# EAGLE design 2164_svf_breakout_planes_smd (EAGLE 9.6.2)
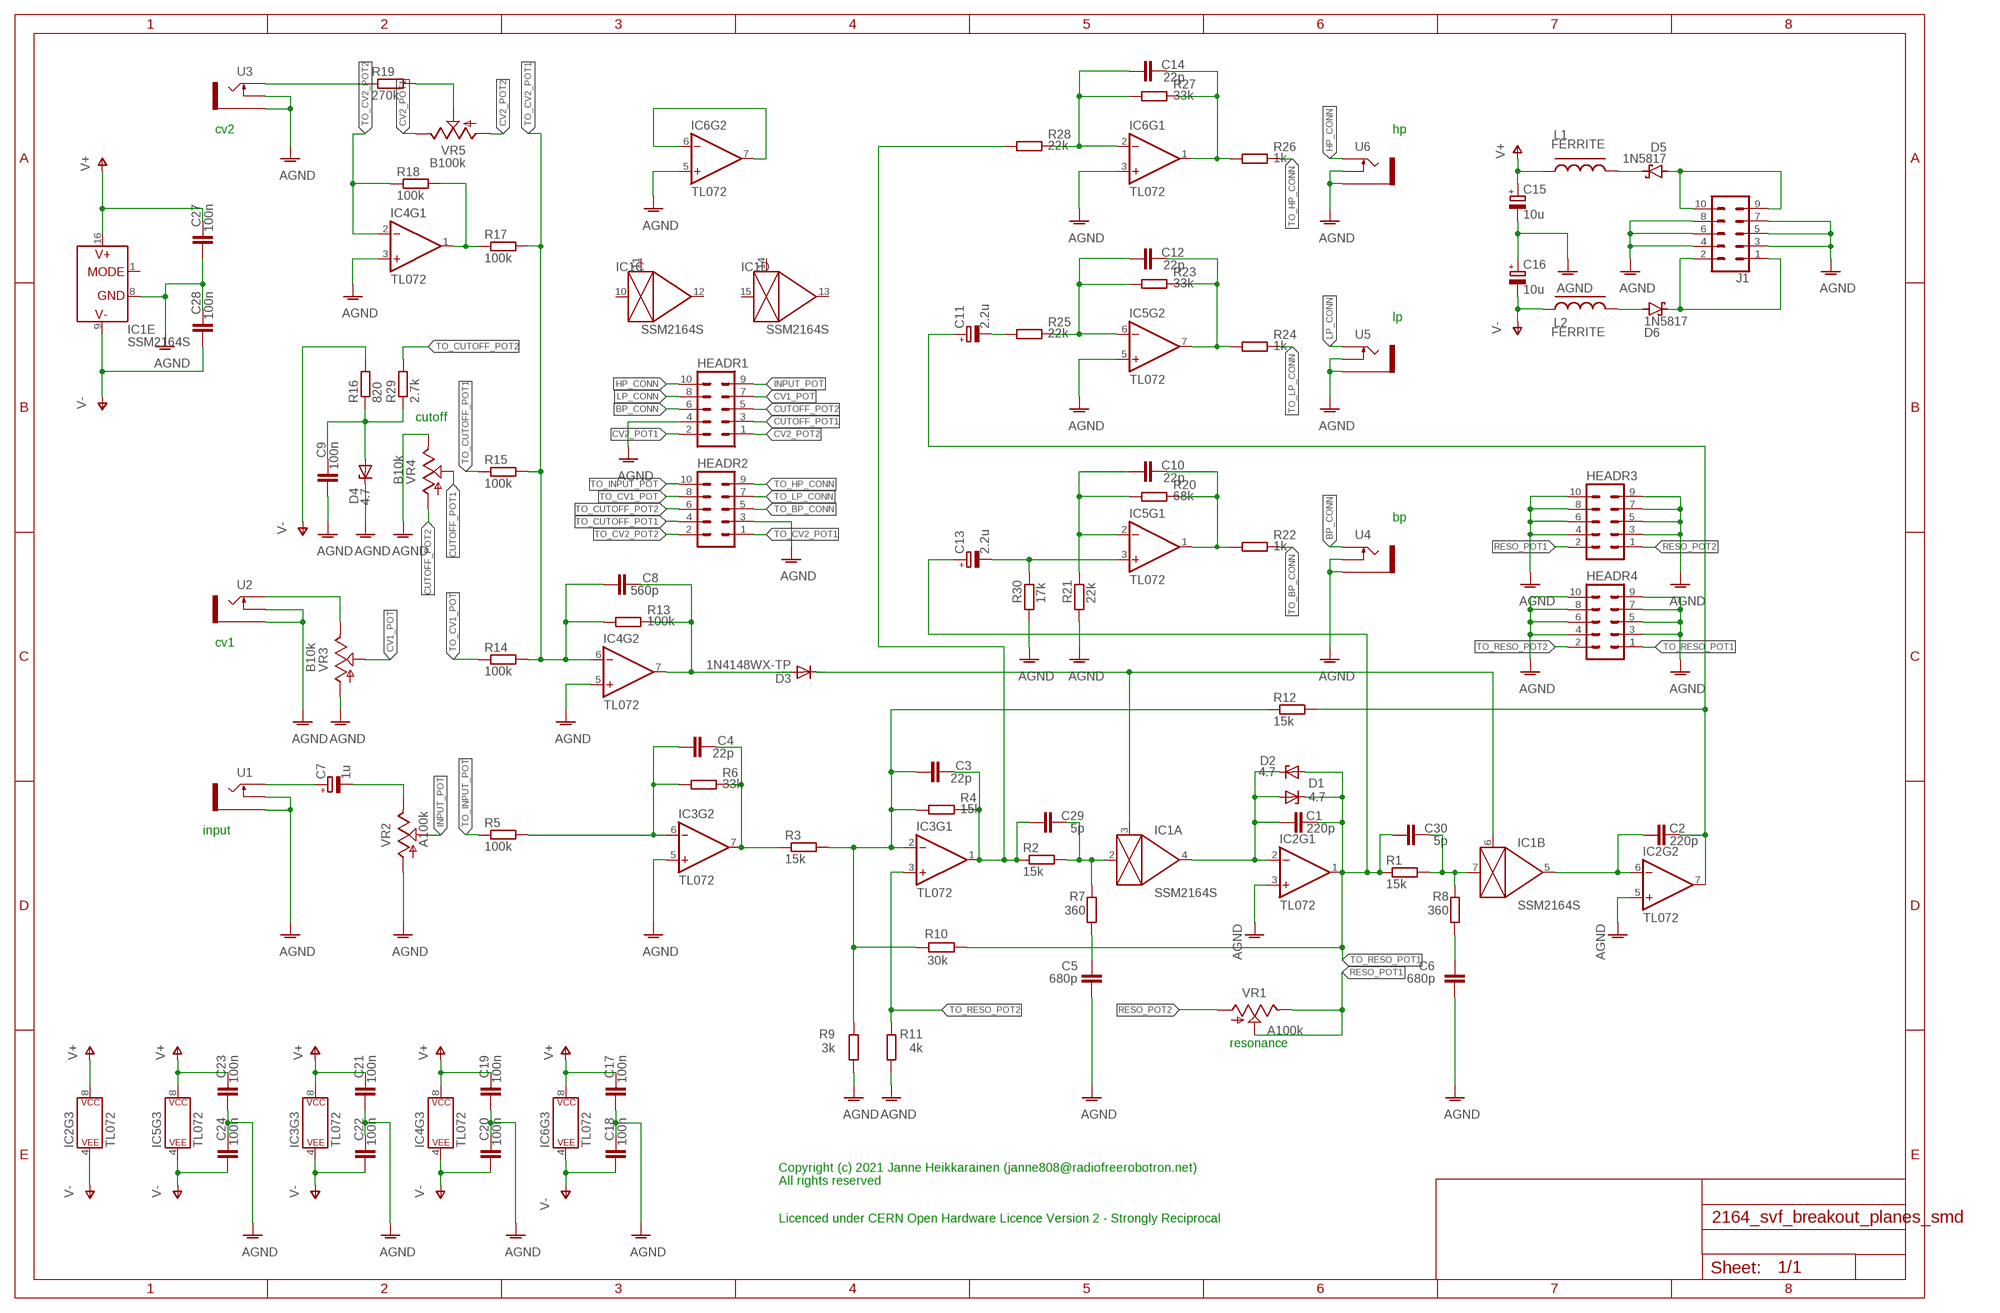
[diagram p0: schematic, sheet 1]

## Parts
C1  220p  C-EUC0603  [C0603]
C2  220p  C-EUC0603  [C0603]
C3  22p  C-EUC0603  [C0603]
C4  22p  C-EUC0603  [C0603]
C5  680p  C-EUC0603  [C0603]
C6  680p  C-EUC0603  [C0603]
C7  1u  CPOL-EUB  [PANASONIC_B]
C8  560p  C-EUC0603  [C0603]
C9  100n  C-EUC0603  [C0603]
C10  22p  C-EUC0603  [C0603]
C11  2.2u  CPOL-EUB  [PANASONIC_B]
C12  22p  C-EUC0603  [C0603]
C13  2.2u  CPOL-EUB  [PANASONIC_B]
C14  22p  C-EUC0603  [C0603]
C15  10u  CPOL-EUB  [PANASONIC_B]
C16  10u  CPOL-EUB  [PANASONIC_B]
C17  100n  C-EUC0603  [C0603]
C18  100n  C-EUC0603  [C0603]
C19  100n  C-EUC0603  [C0603]
C20  100n  C-EUC0603  [C0603]
C21  100n  C-EUC0603  [C0603]
C22  100n  C-EUC0603  [C0603]
C23  100n  C-EUC0603  [C0603]
C24  100n  C-EUC0603  [C0603]
C27  100n  C-EUC0603  [C0603]
C28  100n  C-EUC0603  [C0603]
C29  5p  C-EUC0603  [C0603]
C30  5p  C-EUC0603  [C0603]
D1  4.7  DIODE_ZENER-DIODESOD80C  [DIODE_SOD80C]
D2  4.7  DIODE_ZENER-DIODESOD80C  [DIODE_SOD80C]
D3  1N4148WX-TP  [SOD323R-INFINEON]
D4  4.7  DIODE_ZENER-DIODESOD80C  [DIODE_SOD80C]
D5  1N5817  SCHOTTKY-DIODEDO35-7  [DO35-7]
D6  1N5817  SCHOTTKY-DIODEDO35-7  [DO35-7]
HEADR1  10PIN_BACKSIDE  [10PIN_BACKSIDE]
HEADR2  10PIN_BACKSIDE  [10PIN_BACKSIDE]
HEADR3  10PIN_BACKSIDE  [10PIN_BACKSIDE]
HEADR4  10PIN_BACKSIDE  [10PIN_BACKSIDE]
IC1  SSM2164S  [SOIC16N]
IC2  TL072  OPAMP-DUALU  [SO08]
IC3  TL072  OPAMP-DUALU  [SO08]
IC4  TL072  OPAMP-DUALU  [SO08]
IC5  TL072  OPAMP-DUALU  [SO08]
IC6  TL072  OPAMP-DUALU  [SO08]
J1  CONN_05X2SHD  [2X5-SHROUDED]
L1  FERRITE  EXC3BP  [0603]
L2  FERRITE  EXC3BP  [0603]
R1  15k  R-EU_R0603  [R0603]
R2  15k  R-EU_R0603  [R0603]
R3  15k  R-EU_R0603  [R0603]
R4  15k  R-EU_R0603  [R0603]
R5  100k  R-EU_R0603  [R0603]
R6  33k  R-EU_R0603  [R0603]
R7  360  R-EU_R0603  [R0603]
R8  360  R-EU_R0603  [R0603]
R9  3k  R-EU_R0603  [R0603]
R10  30k  R-EU_R0603  [R0603]
R11  4k  R-EU_R0603  [R0603]
R12  15k  R-EU_R0603  [R0603]
R13  100k  R-EU_R0603  [R0603]
R14  100k  R-EU_R0603  [R0603]
R15  100k  R-EU_R0603  [R0603]
R16  820  R-EU_R0603  [R0603]
R17  100k  R-EU_R0603  [R0603]
R18  100k  R-EU_R0603  [R0603]
R19  270k  R-EU_R0603  [R0603]
R20  68k  R-EU_R0603  [R0603]
R21  22k  R-EU_R0603  [R0603]
R22  1k  R-EU_R0603  [R0603]
R23  33k  R-EU_R0603  [R0603]
R24  1k  R-EU_R0603  [R0603]
R25  22k  R-EU_R0603  [R0603]
R26  1k  R-EU_R0603  [R0603]
R27  33k  R-EU_R0603  [R0603]
R28  22k  R-EU_R0603  [R0603]
R29  2.7k  R-EU_R0603  [R0603]
R30  17k  R-EU_R0603  [R0603]
U1  THONKICONNNEW  [WQP-PJ301M-12_JACK]
U2  THONKICONNNEW  [WQP-PJ301M-12_JACK]
U3  THONKICONNNEW  [WQP-PJ301M-12_JACK]
U4  THONKICONNNEW  [WQP-PJ301M-12_JACK]
U5  THONKICONNNEW  [WQP-PJ301M-12_JACK]
U6  THONKICONNNEW  [WQP-PJ301M-12_JACK]
VR1  A100k  9MM_SNAP-IN_POT_  [9MM_SNAP-IN_POT]
VR2  A100k  9MM_SNAP-IN_POT_  [9MM_SNAP-IN_POT]
VR3  B10k  9MM_SNAP-IN_POT_  [9MM_SNAP-IN_POT]
VR4  B10k  9MM_SNAP-IN_POT_  [9MM_SNAP-IN_POT]
VR5  B100k  9MM_SNAP-IN_POT_  [9MM_SNAP-IN_POT]

## Nets
AGND: C5.1 C6.1 C9.1 C15.- C16.+ C17.1 C18.2 C19.1 C20.2 C21.1 C22.2 C23.1 C24.2 C27.1 C28.2 D4.C HEADR1.4 HEADR2.3 HEADR3.3 HEADR3.4 HEADR3.5 HEADR3.6 HEADR3.7 HEADR3.8 HEADR3.9 HEADR3.10 HEADR4.3 HEADR4.4 HEADR4.5 HEADR4.6 HEADR4.7 HEADR4.8 HEADR4.9 HEADR4.10 IC1.8(E:GND) IC2.3(+IN) IC2.5(+IN) IC3.5(+IN) IC4.3(+IN) IC4.5(+IN) IC5.5(+IN) IC6.3(+IN) IC6.5(+IN) J1.3 J1.4 J1.5 J1.6 J1.7 J1.8 R9.1 R11.1 R21.1 R30.1 U1.P$2_SWITCH(SWITCH) U1.P$3_SLEEVE(SLEEVE) U2.P$2_SWITCH(SWITCH) U2.P$3_SLEEVE(SLEEVE) U3.P$2_SWITCH(SWITCH) U3.P$3_SLEEVE(SLEEVE) U4.P$2_SWITCH(SWITCH) U4.P$3_SLEEVE(SLEEVE) U5.P$2_SWITCH(SWITCH) U5.P$3_SLEEVE(SLEEVE) U6.P$2_SWITCH(SWITCH) U6.P$3_SLEEVE(SLEEVE) VR2.1(A) VR3.1(A) VR4.3(E)
BP_CONN: HEADR1.6 U4.P$1_TIP(TIP)
CUTOFF_POT1: HEADR1.3 VR4.2(S)
CUTOFF_POT2: HEADR1.5 VR4.1(A)
CV1_POT: HEADR1.7 VR3.2(S)
CV2_POT1: HEADR1.2 VR5.3(E)
CV2_POT2: HEADR1.1 VR5.1(A)
HP_CONN: HEADR1.10 U6.P$1_TIP(TIP)
INPUT_POT: HEADR1.9 VR2.2(S)
LP_CONN: HEADR1.8 U5.P$1_TIP(TIP)
N$1: C1.1 D1.A D2.C IC1.4(A:OUT) IC2.2(-IN)
N$2: C2.1 IC1.5(B:OUT) IC2.6(-IN)
N$4: C30.2 IC1.7(B:IN) R1.2 R8.2
N$5: C3.2 C29.1 IC3.1(OUT) R2.1 R4.2 R28.1
N$6: C29.2 IC1.2(A:IN) R2.2 R7.2
N$7: C9.2 D4.A R16.1 R29.1
N$8: C4.2 IC3.7(OUT) R3.1 R6.2
N$9: C3.1 IC3.2(-IN) R3.2 R4.1 R9.2 R10.2 R12.1
N$10: C4.1 IC3.6(-IN) R5.2 R6.1
N$12: C2.2 C11.+ IC2.7(OUT) R12.2
N$13: C7.- VR2.3(E)
N$14: C7.+ U1.P$1_TIP(TIP)
N$15: C5.2 R7.1
N$16: C6.2 R8.1
N$17: C8.2 D3.A IC4.7(OUT) R13.2
N$18: D3.C IC1.3(A:CTRL) IC1.6(B:CTRL)
N$21: U2.P$1_TIP(TIP) VR3.3(E)
N$23: IC4.1(OUT) R17.1 R18.2
N$26: C10.1 IC5.2(-IN) R20.1 R21.2
N$27: R19.1 U3.P$1_TIP(TIP)
N$28: R19.2 VR5.2(S)
N$29: C10.2 IC5.1(OUT) R20.2 R22.1
N$30: C13.- IC5.3(+IN) R30.2
N$31: C12.1 IC5.6(-IN) R23.1 R25.2
N$33: C12.2 IC5.7(OUT) R23.2 R24.1
N$34: C11.- R25.1
N$37: IC6.6(-IN) IC6.7(OUT)
N$38: D5.C L1.2
N$39: C14.2 IC6.1(OUT) R26.1 R27.2
N$40: C14.1 IC6.2(-IN) R27.1 R28.2
N$41: D6.A L2.2
N$42: D6.C J1.1 J1.2
N$43: D5.A J1.9 J1.10
RESO_POT1: HEADR3.2 VR1.2(S) VR1.3(E)
RESO_POT2: HEADR3.1 VR1.1(A)
TO_BP_CONN: HEADR2.5 R22.2
TO_CUTOFF_POT1: HEADR2.4 R15.1
TO_CUTOFF_POT2: HEADR2.6 R29.2
TO_CV1_POT: HEADR2.8 R14.1
TO_CV2_POT1: C8.1 HEADR2.1 IC4.6(-IN) R13.1 R14.2 R15.2 R17.2
TO_CV2_POT2: HEADR2.2 IC4.2(-IN) R18.1
TO_HP_CONN: HEADR2.9 R26.2
TO_INPUT_POT: HEADR2.10 R5.1
TO_LP_CONN: HEADR2.7 R24.2
TO_RESO_POT1: C1.2 C13.+ C30.1 D1.C D2.A HEADR4.1 IC2.1(OUT) R1.1 R10.1
TO_RESO_POT2: HEADR4.2 IC3.3(+IN) R11.2
V+: C15.+ C17.2 C19.2 C21.2 C23.2 C27.2 IC1.16(E:V+) IC2.8(P$V+) IC3.8(P$V+) IC4.8(P$V+) IC5.8(P$V+) IC6.8(P$V+) L1.1
V-: C16.- C18.1 C20.1 C22.1 C24.1 C28.1 IC1.9(E:V-) IC2.4(P$V-) IC3.4(P$V-) IC4.4(P$V-) IC5.4(P$V-) IC6.4(P$V-) L2.1 R16.2
Unconnected: IC1.1(E:MODE) IC1.10(C:IN) IC1.11(C:CTRL) IC1.12(C:OUT) IC1.13(D:OUT) IC1.14(D:CTRL) IC1.15(D:IN)

## Notes on the sheet
- cv2 | hp
- lp
- cutoff
- bp
- cv1
- input
- resonance
- Copyright (c) 2021 Janne Heikkarainen (janne808@radiofreerobotron.net)
  All rights reserved
- Licenced under CERN Open Hardware Licence Version 2 - Strongly Reciprocal

## Library data of the parts
C1-C6 C8-C10 C12 C14 C17-C24 C27-C30 = rcl:C-EU: CAPACITOR, European symbol; SPICEPREFIX: C
C7 C11 C13 C15 C16 = rcl:CPOL-EU: POLARIZED CAPACITOR, European symbol; SPICEPREFIX: C
D1 D2 D4 = Diode-SMD:DIODE_ZENER-DIODE: Z-Diode
D3 = Diode-SMD:1N4148WX-TP
D5 D6 = diode:SCHOTTKY-DIODE: Schottky Diode
HEADR1-HEADR4 = MusicThingModular:10PIN_BACKSIDE: PIN HEADER; OC_FARNELL: unknown; OC_NEWARK: unknown
IC1 = ssm2164:SSM2164
IC2-IC6 = SparkFun-IC-Amplifiers:OPAMP-DUAL: Generic op-amp footprint This component is for the standard 358 pinning of a dual op-amp From the LM358 datasheet: Pin 1: Output A Pin 2: Inverting Input A Pin 3: Non-Inverting Input A Pin 4: Gnd Pin 5: Non-Inverting Input B Pin 6: Inverting Input B Pin 7: Output B Pin 8: V+; PROD_ID: NA-XXXXX; VALUE: OP-AMP
J1 = SparkFun-Connectors:CONN_05X2: Multi connection point. Often used as Generic Header-pin footprint for 0.1 inch spaced/style header connections For AVR SPI programming port, see special device with nice symbol: "AVR_SPI_PROG_5x2.dev" You can populate with any combo of single row headers, but if you'd like an exact match, check these: 2x5 AVR ICSP Male Header <https://www.sparkfun.com/products/778> (PRT-00778) 2x5 Pin Shrouded Header <https://www.sparkfun.com/products/8506> (PRT-08506) On any of the 0.1 inch spaced packages, you can populate with these: Break Away Headers - Straight <https://www.sparkfun.com/products/116> (PRT-00116) Break Away Male Headers - Right Angle <https://www.sparkfun.com/products/553> (PRT-00553) Female Headers <https://www.sparkfun.com/products/115> (PRT-00115) Break Away Headers - Machine Pin <https://www.sparkfun.com/products/117> (PRT-00117) Break Away Female Headers - Swiss Machine Pin <https://www.sparkfun.com/products/743> (PRT-00743) Special note: the shrouded connector mates well with our 5x2 ribbon cables: 2x5 Pin IDC Ribbon Cable <https://www.sparkfun.com/products/8535> (PRT-08535); PROD_ID: CONN-08671; SF_ID: PRT-08506
L1 L2 = barthess:EXC3BP: Chip Bead Core; PARTNO: ?
R1-R30 = rcl:R-EU_: RESISTOR, European symbol; SPICEPREFIX: R
U1-U6 = MusicThingModular:THONKICONN: 3.5mm socket for Eurorack modular synths
VR1-VR5 = MusicThingModular:9MM_SNAP-IN_POT: 9mm vertical snap-in pot, Alpha / Panasonic style

## Board
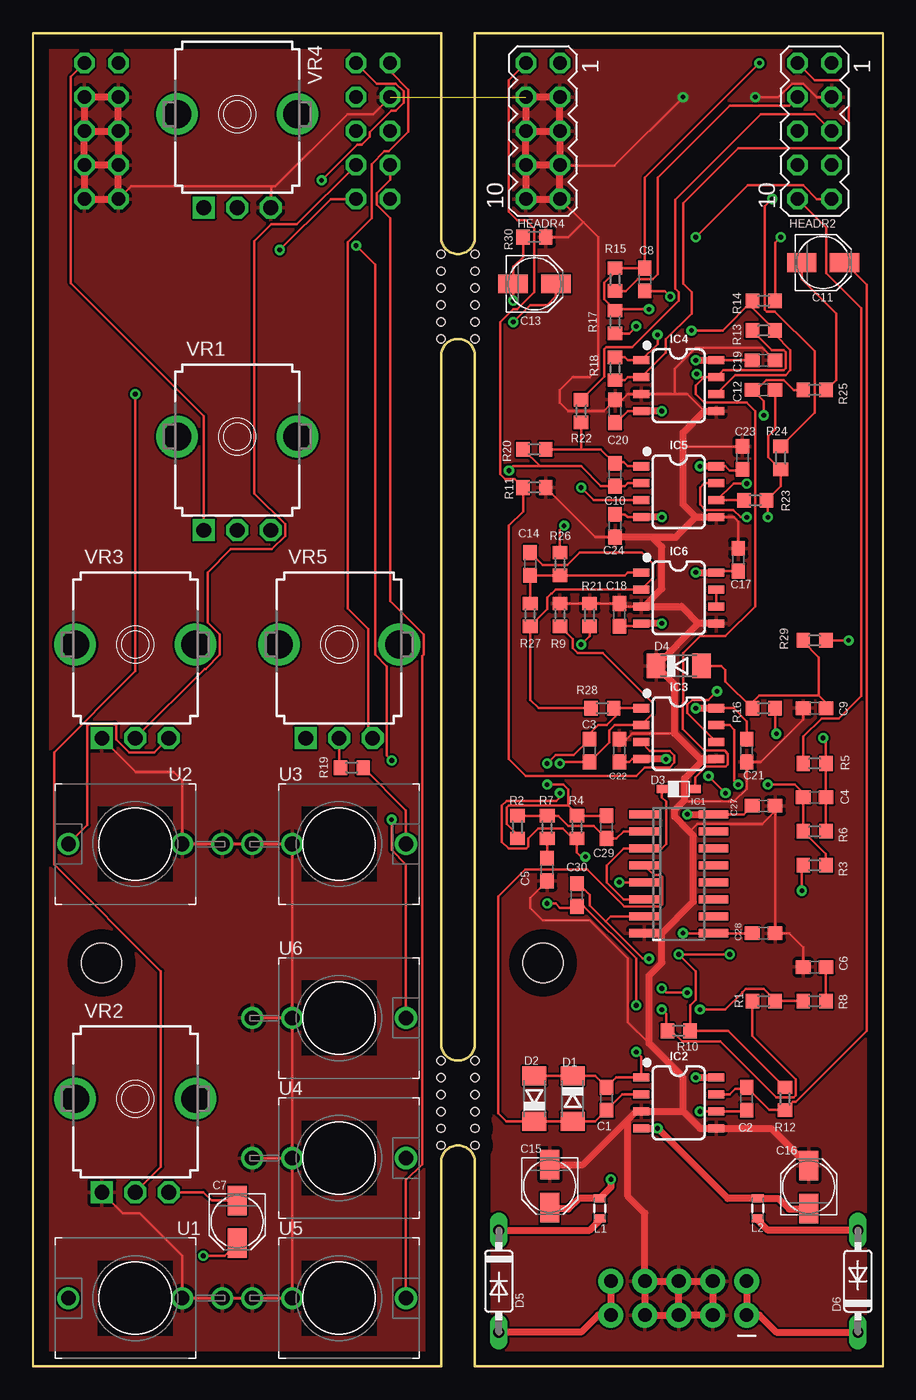
[diagram p1: board, top side]
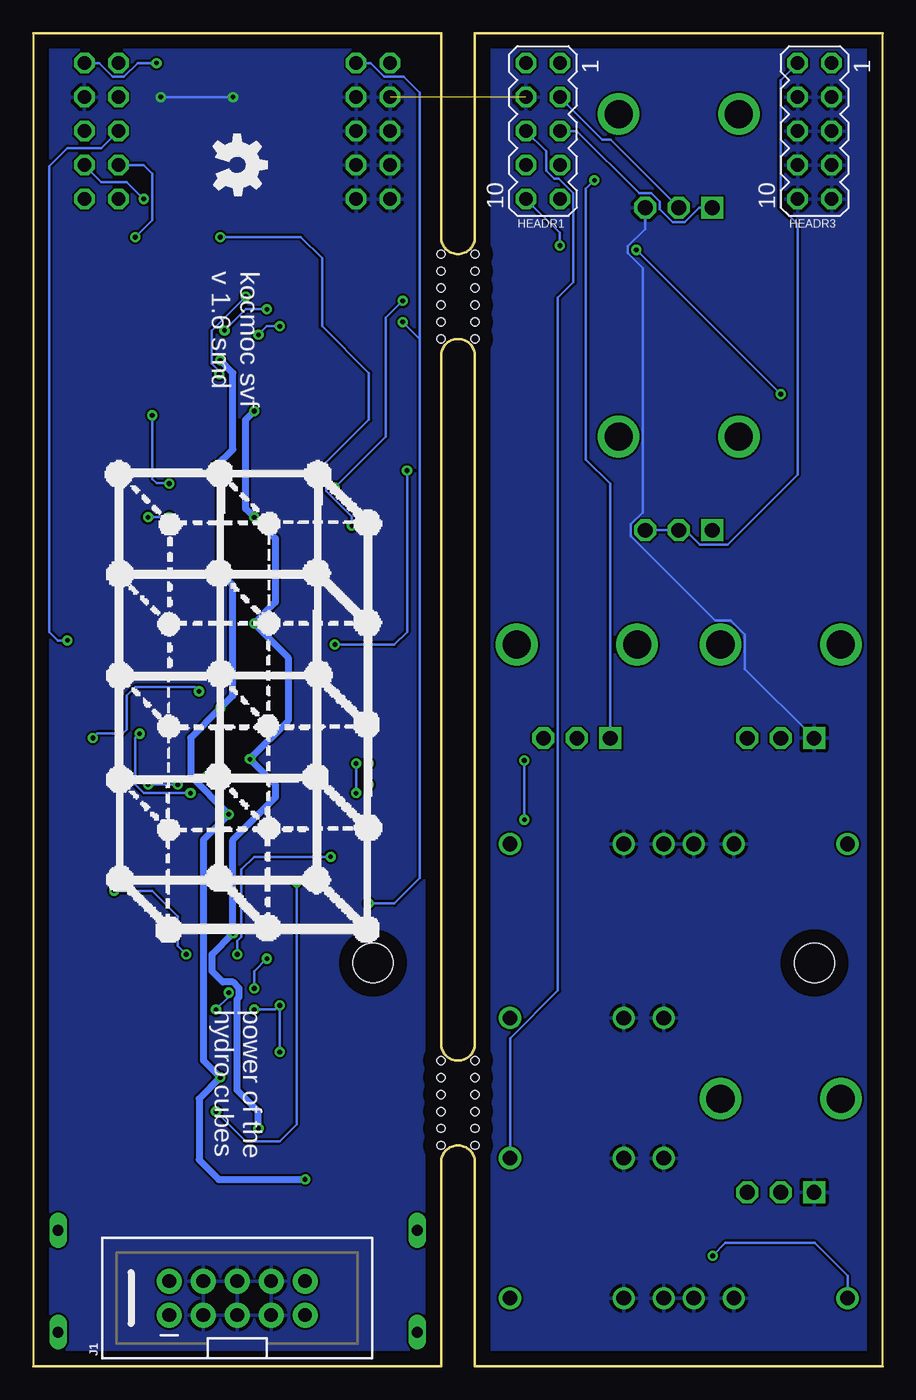
[diagram p2: board, bottom side, seen from below]

Size 63.5 x 99.69 mm. Coordinates in mm from the lower left corner, seen from the top.
Outline: 0,0 0,99.69 30.48,99.69 30.48,84.45 arc180 33.02,84.45 33.02,99.69 63.5,99.69 63.5,0 33.02,0 33.02,15.24 arc180 30.48,15.24 30.48,0 0,0
Outline: 30.48,75.56 arc-180 33.02,75.56 33.02,24.13 arc-180 30.48,24.13 30.48,75.56
Copper layers (1*16): Top 0.035mm / dielectric 1.5mm / Bottom 0.035mm
Design rules "default": minimum track width 6mil, minimum drill 0.35mm, track to track 6mil, track to pad 6mil, pad to pad 6mil, via to via 6mil, smd to smd 6mil, copper to edge 40mil, drill to drill 6mil, minimum pad ring 10mil, minimum via ring 8mil, stop-mask expansion 4mil, vias tented up to drill 0mil, thermal gap 10mil
Holes 3 mm at 5.08,30.16 38.1,30.16
Holes 0.6 mm at 30.48,83.19 33.02,83.19 30.48,81.92 33.02,81.92 30.48,80.64 33.02,80.64 30.48,79.38 33.02,79.38 30.48,78.11 33.02,78.11 30.48,76.83 33.02,76.83 33.02,22.86 30.48,22.86 30.48,21.59 33.02,21.59 33.02,20.32 30.48,20.32 30.48,19.05 33.02,19.05 33.02,17.78 30.48,17.78 30.48,16.51 33.02,16.51

### Footprints (pad centres in the part's own frame; a part is rotated, then mirrored left to right if it is on the bottom)
C0603 = smd 1.1 x 1: 1 -0.85,0; 2 0.85,0
PANASONIC_B = smd 2.2 x 1.4: + 1.6,0; - -1.6,0
DIODE_SOD80C = smd 1.4 x 1.8: A 1.7,0; C -1.7,0
SOD323R-INFINEON = smd 0.8 x 0.6: A 1.25,0; C -1.25,0
DO35-7 = drill 0.813 long: A 3.81,0; C -3.81,0
10PIN_BACKSIDE = drill 1.016 octagon: 1 -5.08,-1.27; 2 -5.08,1.27; 3 -2.54,-1.27; 4 -2.54,1.27; 5 0,-1.27; 6 0,1.27; 7 2.54,-1.27; 8 2.54,1.27; 9 5.08,-1.27; 10 5.08,1.27
SOIC16N = smd 0.6 x 2.2: 1 -4.445,-2.6; 2 -3.175,-2.6; 3 -1.905,-2.6; 4 -0.635,-2.6; 5 0.635,-2.6; 6 1.905,-2.6; 7 3.175,-2.6; 8 4.445,-2.6; 9 4.445,2.6; 10 3.175,2.6; 11 1.905,2.6; 12 0.635,2.6; 13 -0.635,2.6; 14 -1.905,2.6; 15 -3.175,2.6; 16 -4.445,2.6
SO08 = smd 0.6 x 1.2: 1 -1.905,-2.8; 2 -0.635,-2.8; 3 0.635,-2.8; 4 1.905,-2.8; 5 1.905,2.8; 6 0.635,2.8; 7 -0.635,2.8; 8 -1.905,2.8
2X5-SHROUDED = drill 1.016 pad 1.88: 1 -1.27,5.08; 2 1.27,5.08; 3 -1.27,2.54; 4 1.27,2.54; 5 -1.27,0; 6 1.27,0; 7 -1.27,-2.54; 8 1.27,-2.54; 9 -1.27,-5.08; 10 1.27,-5.08
0603 = smd 0.6 x 0.9: 1 -0.8,0; 2 0.7,0
R0603 = smd 1 x 1.1: 1 -0.85,0; 2 0.85,0
WQP-PJ301M-12_JACK = drill 1.1: P$1_TIP 0,5; P$2_SWITCH 0,-3.5; P$3_SLEEVE 0,-6.5
9MM_SNAP-IN_POT = drill 1.1 square: 1 -2.5,-7 | drill 1.1 octagon: 2 0,-7; 3 2.5,-7 | drill 2.1 pad 2.794: CHASSIS1 -4.5,0; CHASSIS2 4.5,0

### Placement (x,y rotation side)
C1  42.86,20 90 top
C2  53.34,20 90 top
C3  41.59,46.04 90 top
C4  58.42,42.55 180 top
C5  38.42,37.15 90 top
C6  58.42,29.84 0 top
C7  15.24,10.79 270 top
C8  45.72,81.28 270 top
C9  58.42,49.21 0 top
C10  43.5,66.67 90 top
C11  59.05,82.55 0 top
C12  54.61,73.03 0 top
C13  37.47,80.96 0 top
C14  37.15,60.01 270 top
C15  38.61,13.46 270 top
C16  57.98,13.4 90 top
C17  52.7,60.33 270 top
C18  43.81,56.2 90 top
C19  54.61,75.25 180 top
C20  43.5,71.44 90 top
C21  53.34,46.04 90 top
C22  43.81,46.04 90 top
C23  53.02,67.94 270 top
C24  43.5,62.87 270 top
C27  54.61,41.91 180 top
C28  54.61,32.38 0 top
C29  42.86,40.32 270 top
C30  40.64,35.24 90 top
D1  40.32,20 270 top
D2  37.47,20 90 top
D3  48.26,43.18 0 top
D4  48.26,52.39 0 top
D5  34.8,6.35 270 top
D6  61.66,6.35 90 top
HEADR1  25.4,92.39 270 top
HEADR2  58.42,92.39 270 bottom
HEADR3  5.08,92.39 270 top
HEADR4  38.1,92.39 270 bottom
IC1  48.26,36.83 270 top
IC2  48.26,19.68 270 top
IC3  48.26,47.31 270 top
IC4  48.26,73.34 270 top
IC5  48.26,65.41 270 top
IC6  48.26,57.47 270 top
J1  48.26,5.08 90 bottom
L1  42.35,11.75 270 top
L2  54.17,11.75 270 top
R1  54.61,27.3 0 top
R2  36.2,40.32 90 top
R3  58.42,37.47 180 top
R4  40.64,40.32 90 top
R5  58.42,45.09 0 top
R6  58.42,40.01 180 top
R7  38.42,40.32 90 top
R8  58.42,27.3 180 top
R9  39.37,56.2 270 top
R10  48.26,25.08 0 top
R11  37.47,65.72 180 top
R12  56.2,20 270 top
R13  54.61,77.47 180 top
R14  54.61,79.69 180 top
R15  43.5,81.28 90 top
R16  54.61,49.21 0 top
R17  43.5,78.11 90 top
R18  43.5,74.61 90 top
R19  23.81,44.77 180 top
R20  37.47,68.58 0 top
R21  41.59,56.2 270 top
R22  40.96,71.44 90 top
R23  53.98,64.77 0 top
R24  55.88,67.94 90 top
R25  58.42,73.03 180 top
R26  39.37,60.01 90 top
R27  37.15,56.2 90 top
R28  42.55,49.21 180 top
R29  58.42,54.29 0 top
R30  37.47,84.45 180 top
U1  7.62,5.08 90 top
U2  7.62,39.05 90 top
U3  22.86,39.05 270 top
U4  22.86,15.56 270 top
U5  22.86,5.08 270 top
U6  22.86,26.04 270 top
U$1  [OSHW_5MM]  48.26,89.85 270 bottom
VR1  15.24,69.53 0 top
VR2  7.62,20 0 top
VR3  7.62,53.98 0 top
VR4  15.24,93.66 0 top
VR5  22.86,53.98 0 top

### Tracks (layer width: path | path; a pad name or v marks a point on that pad's centre or on a via)
AGND  (via drill 0.35)  (1 unrouted)
  Top 0.2: C28.2 55.56,32.38 | 57.57,49 C9.1 | 48.47,56.83 48.58,56.72 | IC4.3 47.94,72.71 | 47.94,72.71 48.9,72.71 50.16,71.44 | IC4.3 46.04,72.71 | v48.58,94.93 43.43,89.79 39.44,89.79 HEADR4.7 | IC4.5 51.12,71.38 | 55.17,75.25 C19.1 54.51,76.2 49.53,76.2 47.94,74.61 47.94,72.71 | IC4.3 44.45,72.71 44.03,72.29 C20.2 42.65,71.44 40.01,71.44 39.37,72.07 39.37,73.03 40.32,73.98 41.59,73.98 42.23,74.61 42.23,84.45 41.12,85.57 | 57.57,49.1 C9.1 | C22.2 44.35,46.89 44.77,47.31 47.94,47.31 | 48.58,42.23 52.39,42.23 53.34,43.18 C21.1 54.4,45.19 57.57,48.36 C9.1 | IC6.3 44.03,56.83 C18.2 R21.1 R9.1 | C23.1 48.68,68.8 48.58,68.9 | C24.2 42.02,62.02 R11.1 | IC5.5 52.39,63.5 52.7,63.18 C17.1 | 48.97,40.08 49.17,40.08 49.66,40.56 54.49,40.56 55.46,41.52 C27.1 C28.2 | 46.04,24.13 44.45,25.72 44.45,30.48 41.59,33.34 38.1,33.34 37.15,34.29 37.15,35.03 C5.1 | C28.2 56.52,32.38 57.57,31.33 C6.1 | VR3.1 7.64,44.45 10.48,44.45 11.12,43.81 U2.P$2_SWITCH U2.P$3_SLEEVE U3.P$3_SLEEVE U3.P$2_SWITCH U6.P$2_SWITCH | U6.P$3_SLEEVE U6.P$2_SWITCH | U4.P$3_SLEEVE U4.P$2_SWITCH | U4.P$2_SWITCH U5.P$2_SWITCH U5.P$3_SLEEVE U1.P$3_SLEEVE U1.P$2_SWITCH 11.12,8.25 7.94,11.43 6.67,11.43 5.12,12.98 VR2.1 | U4.P$2_SWITCH U6.P$2_SWITCH | HEADR3.10 7.3,88.27 17.78,88.27 | 17.78,88.27 17.78,86.7 VR4.3 | 17.78,88.27 18.1,88.27 23.5,93.66 25.4,93.66 HEADR1.4 | 41.12,85.57 HEADR4.9 | v53.98,94.93 55.72,94.93 56.73,95.95 57.57,95.95 58.59,94.93 HEADR2.3 | R30.1 40.01,84.45 41.12,85.57
  Top 0.508: 44.45,18.41 | 44.45,18.41 45.09,19.05 IC2.3 48.58,19.05 | 48.58,19.05 49.85,17.78 IC2.5 55.19,17.78 C16.+ | 48.58,19.05 48.58,21.59 46.04,24.13 46.04,29.21 46.99,30.16 46.99,32.38 | 49.73,55.56 D4.C 47.94,51.01 47.94,47.31 49.85,45.4 IC3.5 51.01,45.36 50.1,45.36 48.7,43.96 48.7,42.35 48.58,42.23 47.94,41.59 47.94,41.1 48.97,40.08 49.35,39.69 49.35,34.75 46.99,32.38 | IC6.5 49.73,55.56 | 49.73,55.56 48.58,56.72 | 49.53,63.5 IC5.5 | 49.53,63.5 48.58,64.45 48.58,68.9 48.58,69.85 50.16,71.44 IC4.5 | IC1.8 46.99,32.38 | C15.- 41.1,15.06 44.45,18.41 | 48.47,56.83 IC6.3 45.66,56.83 46.99,58.16 46.99,61.28 46.25,62.02 | 46.25,62.02 C24.2 | 46.25,62.02 48.05,62.02 49.53,63.5 | J1.8 J1.6 | J1.6 J1.4 J1.3 J1.5 | J1.5 J1.6 | J1.8 J1.7 J1.5 | 44.45,18.41 44.45,12.7 45.72,11.43 J1.8 | HEADR3.8 HEADR3.10 HEADR3.9 HEADR3.7 | HEADR3.8 HEADR3.7 | HEADR3.7 HEADR3.5 | HEADR3.5 HEADR3.6 | HEADR3.6 HEADR3.8 | HEADR3.6 HEADR3.4 HEADR3.3 HEADR3.5 | HEADR4.7 HEADR4.9 HEADR4.10 HEADR4.8 | HEADR4.7 HEADR4.8 | HEADR4.8 HEADR4.6 | HEADR4.6 HEADR4.5 | HEADR4.5 HEADR4.7 | HEADR4.5 HEADR4.3 HEADR4.4 HEADR4.6
  Bottom 0.2: v48.58,94.93 v53.98,94.93 | VR3.1 10.31,52.16 10.31,54.73 11.37,55.78 12.52,55.78 18.82,62.09 18.82,62.98 17.93,63.87 17.93,82.12 19.05,83.24 19.05,83.76 17.74,85.07 VR4.3
  pour Top: 1.27,0.64 29.21,0.64 29.21,99.06 1.27,99.06
  pour Bottom: 1.27,0.64 29.21,0.64 29.21,99.06 1.27,99.06
  pour Top: 34.29,0.64 62.23,0.64 62.23,99.06 34.29,99.06
  pour Bottom: 34.29,99.06 34.29,0.64 62.23,0.64 62.23,99.06
BP_CONN
  Bottom 0.2: U4.P$1_TIP 27.86,24.51 24.28,28.09 24.28,79.92 23.12,81.08 23.12,87.73 24.22,88.84 24.55,88.84 25.14,89.43 25.14,90.87 HEADR1.6
CUTOFF_POT1
  Bottom 0.2: VR4.2 20.34,91.76 20.95,91.76 HEADR1.3
CUTOFF_POT2
  Bottom 0.2: VR4.1 13.72,86.66 14.79,85.58 15.69,85.58 16.66,86.56 16.66,87.11 17.29,87.74 18.21,87.74 22.86,92.39 HEADR1.5
CV1_POT
  Top 0.2: VR3.2 12.81,52.16 12.87,52.16 13.93,53.23 13.93,54.73 13.02,55.64 13.02,59.37 14.75,61.1 17.83,61.1 18.82,62.09 18.82,62.98 16.51,65.29 16.51,84.14 17.78,85.41 19.68,85.41 HEADR1.7
CV2_POT1
  Top 0.2: VR5.3 25.04,47.29 25.04,55.14 23.5,56.68 23.5,84.08 25.3,85.89 25.3,89.92 26.25,90.87 26.58,90.87 28.04,92.33 28.04,95.5 26.67,96.86 HEADR1.2
CV2_POT2  (via drill 0.35)
  Top 0.2: v21.55,88.71 24.22,91.38 24.55,91.38 25.14,91.97 25.14,92.3 26.76,93.92 27.09,93.92 27.68,94.51 27.68,95.35 27.09,95.95 25.66,95.95 HEADR1.1
  Bottom 0.2: VR5.1 20.36,66 22.18,67.83 22.18,88.07 v21.55,88.71
HP_CONN  (via drill 0.35)
  Top 0.2: U6.P$1_TIP 27.86,37.53 26.78,38.61 v26.78,40.87 | v26.8,45.3 26.44,45.67 26.44,52.34 25.55,53.23 25.55,82.4 v24.13,83.82
  Bottom 0.2: v26.8,45.3 26.8,40.89 v26.78,40.87 | v24.13,83.82 24.13,84.77 HEADR1.10
INPUT_POT  (via drill 0.35)
  Top 0.2: VR2.2 9.53,14.91 9.53,29.53 1.54,37.51 1.54,45.9 7.62,51.98 v7.62,72.71 | v18.41,83.5 22.23,87.31 HEADR1.9
  Bottom 0.2: v7.62,72.71 v18.41,83.5
LP_CONN
  Top 0.2: U5.P$1_TIP 27.86,13.89 29.06,15.09 29.06,53.12 29.17,53.23 29.17,54.73 26.67,57.23 26.67,85.88 25.66,86.89 25.66,87.73 26.67,88.75 HEADR1.8
N$1
  Top 0.2: IC2.2 44.03,20.32 C1.1 42.01,18.3 D1.A D2.C 35.35,18.3 34.75,18.9 34.75,35.12 36.78,37.15 41.41,37.15 44.19,34.37 46.87,34.37 47.01,34.52 47.01,36.6 46.87,36.75 46.38,36.75 IC1.4
N$2  (via drill 0.35)
  Top 0.2: C2.1 53.24,19.05 IC2.6 v49.85,19.05 | v43.81,36.2 IC1.5
  Bottom 0.2: v49.85,19.05 47.62,16.83 45.09,16.83 43.81,18.1 v43.81,36.2
N$4  (via drill 0.35)
  Top 0.2: R8.2 R1.2 55.46,27.37 54.61,28.22 53.27,28.22 53.01,27.96 53.01,27.93 51.75,26.67 v49.85,26.67 | v46.04,30.48 45.58,30.48 42.79,33.27 | v48.9,27.94 47.31,27.94 v46.99,28.26 | C30.2 40.74,36.09 41.59,35.24 41.59,34.47 42.79,33.27 | 42.79,33.27 43.18,33.66 IC1.7
  Bottom 0.2: v46.04,30.48 46.99,29.53 v46.99,28.26 | v49.85,26.67 48.9,27.62 v48.9,27.94
N$5  (via drill 0.35)
  Top 0.2: R28.1 43.5,49.21 | 43.5,49.21 IC3.1 | 43.5,49.21 43.5,48.58 42.86,47.94 42.23,47.94 41.59,47.31 C3.2 40.42,45.72 39.05,45.72 v38.42,45.09 | R2.1 36.2,39.77 35.39,40.57 35.39,41.78 35.54,41.92 39.99,41.92 | 39.99,41.92 40.64,41.27 R4.2 C29.1 | 39.99,41.92 39.99,42.59 40,42.6 40,43.12 39.63,43.49 v38.42,43.49 v38.42,43.5
  Bottom 0.2: v38.42,43.5 v38.42,45.09
N$6
  Top 0.2: R2.2 R7.2 39.23,41.17 39.98,40.42 41.91,40.42 C29.2 43.6,39.47 44.13,40.01 IC1.2
N$7
  Top 0.2: D4.A 51.44,52.39 51.75,52.07 51.75,51.22 R16.1 53.76,49.63 54.29,50.16 58.74,50.16 | R29.1 57.52,54.24 58.74,53.02 58.74,50.16 | 58.74,50.16 59.27,49.63 C9.2
N$8  (via drill 0.35)
  Top 0.2: R3.1 59.27,38.3 R6.2 C4.2 57.57,42.86 56.94,43.5 v54.93,43.5 | IC3.7 52.07,47.94 52.42,47.59 52.42,43.78 v52.7,43.5
  Bottom 0.2: v52.7,43.5 v54.93,43.5
N$9  (via drill 0.35)
  Top 0.2: R12.1 51.97,25.08 R10.2 49.11,26.99 49.53,27.4 49.53,29.53 v48.26,30.8 v52.07,30.8 | R3.2 57.47,37.47 v57.47,35.56 | R9.2 40.33,54.39 40.33,53.71 40.7,53.34 42.59,53.34 46.31,49.62 46.31,48.81 45.46,47.96 IC3.2 43.46,47.94 43.06,47.54 43.06,46.66 C3.1 39.47,45.19 v39.37,45.09 | v39.37,42.86 39.37,42.55 39.1,42.28 35.39,42.28 35.04,41.92 35.04,39.22 35.54,38.72 36.85,38.72 37,38.87 37,39.46 37.76,40.23 39.57,40.23 40.33,39.47 R4.1 40.64,38.42 40.96,38.1 v41.27,38.1
  Bottom 0.2: v52.07,30.8 52.7,31.43 52.7,33.66 54.61,35.56 v57.47,35.56 | v39.37,42.86 v39.37,45.09 | v41.27,38.1 46.99,38.1 47.95,37.14 47.95,32.12 48.26,31.81 v48.26,30.8
N$10  (via drill 0.35)
  Top 0.2: R6.1 C4.1 R5.2 59.27,46.77 v59.05,46.99 | IC3.6 51.06,46.69 48.9,48.85 48.9,49.47 49.27,49.84 50.48,49.84 v51.12,50.48
  Bottom 0.2: v51.12,50.48 51.44,50.8 55.88,50.8 56.52,50.16 56.52,47.62 56.83,47.31 58.74,47.31 v59.05,46.99
N$12
  Top 0.2: C2.2 53.45,20.75 | 53.45,20.75 55.04,19.15 R12.2 56.79,19.75 57,19.75 62.31,25.06 62.31,80.9 C11.+ | IC2.7 52.07,20.32 52.49,20.75 53.45,20.75
N$13
  Top 0.2: VR2.3 12.71,13 13.34,12.38 15.23,12.38 C7.-
N$14  (via drill 0.35)
  Top 0.2: C7.+ 14.3,8.26 v12.7,8.26
  Bottom 0.2: U1.P$1_TIP 2.62,6.75 5.08,9.21 11.75,9.21 v12.7,8.26
N$15
  Top 0.2: R7.1 C5.2
N$16
  Top 0.2: R8.1 C6.2
N$17  (via drill 0.35)
  Top 0.2: D3.A 49.51,44.05 50.31,44.85 51.77,44.85 51.91,45 51.91,45.81 51.68,46.04 50.16,46.04 48.55,47.66 48.55,49.62 48.58,49.65 48.58,53.34 49.85,54.61 51.75,54.61 53.98,56.83 53.98,71.44 53.34,72.07 50.16,72.07 49.53,72.71 49.53,73.34 50.16,73.98 IC4.7 | IC4.7 51.58,74.5 56.12,74.5 56.26,74.64 56.26,75.85 56.12,76 55.23,76 R13.2 | C8.2 47.2,80.43 v47.62,80.01 | v49.61,74.22 49.85,73.98 IC4.7
  Bottom 0.2: v47.62,80.01 50.16,77.47 50.16,74.99 49.53,74.36 49.53,74.3 v49.61,74.22
N$18
  Top 0.2: IC1.6 44.13,34.92 42.86,36.2 42.86,37.47 44.13,38.73 IC1.3 46.99,38.73 47.31,39.05 47.31,42.23 46.99,42.55 46.99,43.16 D3.C
N$21
  Top 0.2: VR3.3 9.04,45.9 7.17,45.9 6.2,46.87 6.2,47.91 6.05,48.05 4.19,48.05 4.04,47.91 4.04,40.48 U2.P$1_TIP
N$23  (via drill 0.35)
  Top 0.2: R18.2 44.23,75.46 44.45,75.25 IC4.1 46.67,76.46 v46.67,77.15 | R17.1 44.55,77.25 v45.09,77.79
  Bottom 0.2: v46.67,77.15 46.04,77.79 v45.09,77.79
N$26  (via drill 0.35)
  Top 0.2: IC5.2 44.45,66.04 44.23,65.83 C10.1 42.44,65.83 40.96,67.31 37.88,67.31 | 37.88,67.31 R20.1 | 37.88,67.31 35.88,67.31 v35.56,66.99 | v40.96,53.98 41.59,54.61 R21.2
  Bottom 0.2: v40.96,53.98 36.51,53.98 35.56,54.93 v35.56,66.99
N$27
  Top 0.2: R19.1 27.86,41.57 U3.P$1_TIP
N$28
  Top 0.2: R19.2 22.86,44.87 VR5.2
N$29
  Top 0.2: IC5.1 44.45,67.31 44.13,67.63 43.6,67.63 C10.2 42.44,68.58 40.96,68.58 | 40.96,68.58 R20.2 | R22.1 40.96,68.58
N$30  (via drill 0.35)
  Top 0.2: v40.96,65.72 41.91,64.77 IC5.3 | R30.2 36.62,82.97 35.88,82.23 C13.- | C13.- | C13.- v35.88,79.69
  Bottom 0.2: v40.96,65.72 37.14,69.54 37.14,78.43 v35.88,79.69
N$31  (via drill 0.35)
  Top 0.2: R25.2 56.87,73.03 56.12,73.78 54.8,73.78 54.05,73.03 C12.1 54.61,72.17 v54.61,71.12 | IC5.6 51.12,64.77 | 51.12,64.77 R23.1 | v53.34,66.01 52.36,66.01 51.12,64.77
  Bottom 0.2: v54.61,71.12 54.61,66.36 54.29,66.04 53.34,66.04 v53.34,66.01
N$33  (via drill 0.35)
  Top 0.2: C12.2 55.46,70.06 54.96,69.57 54.96,68.01 R24.1 55.88,65.83 R23.2 54.93,64.67 v54.93,63.5 | IC5.7 50.16,66.04 49.85,65.72 49.85,64.45 50.25,64.05 52.33,64.05 52.89,63.5 v53.34,63.5
  Bottom 0.2: v53.34,63.5 v54.93,63.5
N$34
  Top 0.2: R25.1 60.02,73.78 60.02,78.74 57.47,81.3 57.47,82.54 C11.-
N$37
  Top 0.2: IC6.7 IC6.6
N$38
  Top 0.508: D5.C 41.59,10.16 42.35,10.92 L1.2
N$39
  Top 0.2: R27.2 C14.2 R26.1 44.23,59.16 44.45,59.37 IC6.1
N$40
  Top 0.2: R28.2 37.78,49.21 37.15,49.85 R27.1 38.42,56.62 38.42,57.5 38.72,57.8 38.75,57.8 39.05,58.1 IC6.2 46.35,59 46.35,60.01 45.51,60.86 40.85,60.86 39.91,59.91 38.09,59.91 C14.1
N$41
  Top 0.508: D6.A 54.93,10.16 54.17,10.92 L2.2
N$42
  Top 0.508: J1.2 J1.1 54.29,3.81 55.56,2.54 D6.C
N$43
  Top 0.508: J1.10 J1.9 42.23,3.81 40.96,2.54 D5.A
RESO_POT1
  Bottom 0.2: VR1.3 VR1.2 14.75,62.53 13.67,61.45 11.57,61.45 6.35,66.67 6.35,85.41 7.62,86.68 7.62,96.2 HEADR3.2
RESO_POT2
  Top 0.2: VR1.1 12.74,71.08 2.8,81.02 2.8,96.46 HEADR3.1
TO_BP_CONN
  Top 0.2: R22.2 42.7,74.03 42.7,76.07 42.84,76.22 44.78,76.22 48.26,79.69 48.26,80.33 47.99,80.59 47.99,87.26 54.4,93.66 58.42,93.66 HEADR2.5
TO_CUTOFF_POT1
  Top 0.2: R15.1 44.31,80.43 45.21,81.33 46.33,81.33 46.67,81.68 46.67,88.9 52.07,94.3 56.52,94.3 HEADR2.4
TO_CUTOFF_POT2  (via drill 0.35)
  Top 0.2: v60.96,54.29 R29.2
  Bottom 0.2: v60.96,54.29 61.67,54.29 62.31,54.93 62.31,89.78 60.96,91.12 58.42,91.12 HEADR2.6
TO_CV1_POT  (via drill 0.35)
  Top 0.2: v55.88,84.45 55.46,84.03 R14.1
  Bottom 0.2: v55.88,84.45 54.61,85.72 54.61,89.22 55.24,89.85 HEADR2.8
TO_CV2_POT1  (via drill 0.35)
  Top 0.2: 45.72,82.23 45.72,88.9 v54.29,97.47 | 45.72,82.23 C8.1 | IC4.6 52.49,74.14 56.26,74.14 56.62,74.5 56.62,76 55.46,77.15 R13.1 53.76,79.17 R14.2 51.54,77.47 v49.21,77.47 | 45.72,82.23 45.62,82.13 R15.2 43.5,81.84 42.7,81.03 42.7,79.83 43.5,79.02 R17.2 43.6,79.06 v46.04,79.06
  Bottom 0.2: v49.21,77.47 47.62,79.06 v46.04,79.06 | v54.29,97.47 55.72,97.47 56.73,96.46 57.57,96.46 58.59,97.47 HEADR2.1
TO_CV2_POT2
  Top 0.2: R18.1 44.23,73.76 44.45,73.98 IC4.2 47.3,75.83 47.3,76.83 49.21,78.74 49.21,80.33 48.58,80.96 48.58,87 52.7,91.12 60.33,91.12 60.96,91.76 60.96,95.57 60.33,96.2 58.42,96.2 HEADR2.2
TO_HP_CONN  (via drill 0.35)
  Top 0.2: R26.2 39.37,62.55 v39.69,62.87 | HEADR2.9 58.59,87.31 57.57,88.33 53.4,88.33 v49.53,84.45
  Bottom 0.2: v39.69,62.87 39.69,63.56 41.59,65.46 41.59,67.63 38.42,70.8 38.42,74.3 41.91,77.79 41.91,82.87 43.5,84.45 v49.53,84.45
TO_INPUT_POT
  Top 0.2: R5.1 57.57,47.09 58.94,48.46 60.24,48.46 61.91,50.13 61.91,79.14 59.3,81.75 59.3,85.16 HEADR2.10
TO_LP_CONN  (via drill 0.35)
  Top 0.2: R24.2 58.42,71.33 58.42,75.92 55.45,78.89 54.85,78.89 54.71,79.04 54.71,86.78 v55.24,87.31
  Bottom 0.2: v55.24,87.31 56.52,88.58 58.42,88.58 HEADR2.7
TO_RESO_POT1  (via drill 0.35)
  Top 0.2: D2.A D1.C 42.01,21.7 C1.2 43.6,21.59 IC2.1 45.46,23.12 v45.09,23.5 | v46.99,26.67 47.31,26.35 47.31,25.4 47.41,25.3 R10.1 47.7,25.08 48.51,24.28 51.36,24.28 55.54,20.1 56.85,20.1 57,20.25 57,21.46 53.76,24.7 R1.1 | v45.09,26.99 45.09,30.48 41.17,34.39 C30.1 40.54,34.29 39.37,34.29 39.05,34.61 v38.42,34.61 | v35.88,78.11 37.15,79.38 38.42,79.38 39.06,80.02 C13.+
  Bottom 0.2: v46.99,26.67 45.4,26.67 v45.09,26.99 v45.09,23.5 | v35.88,78.11 34.61,76.83 | v38.42,34.61 36.51,34.61 34.61,36.51 34.61,76.83 | 34.61,76.83 34.61,95.25 35.82,96.46 37.25,96.46 38.27,97.47 HEADR4.1
TO_RESO_POT2
  Top 0.2: IC3.3 46.1,46.03 47.57,46.03 47.94,45.66 47.94,45.14 47.57,44.77 45.72,44.77 45.09,44.13 36.83,44.13 35.56,45.4 35.56,62.87 36.62,63.92 R11.2 35.98,66.36 35.3,66.36 34.92,66.74 34.92,78.11 35.88,79.06 36.2,79.06 37.47,80.33 37.47,85.09 36.83,85.72 36.2,85.72 35.56,86.36 35.56,96.2 HEADR4.2
V+  (via drill 0.35)
  Top 0.2: IC3.8 52.35,49.21 53.34,48.23 C21.2 | IC4.8 C19.2 | C27.2 53.12,41.27 IC1.16 | IC6.8 51.16,59.48 C17.2 | IC5.8 51.75,67.31 52.07,66.99 52.92,66.99 C23.2
  Top 0.508: v49.53,21.59 IC2.8 | v48.9,41.27 IC1.16 | v49.53,49.21 IC3.8 | v49.53,59.37 IC6.8 | v49.85,67.31 IC5.8 | v49.53,75.25 IC4.8 | C15.+ 38.72,11.75 40.01,11.75 40.8,12.55 L1.1 43.18,13.37 v43.18,13.97
  Bottom 0.508: v49.53,75.25 48.58,74.3 48.58,68.58 v49.85,67.31 49.53,66.99 v49.53,59.37 48.58,58.42 48.58,50.16 v49.53,49.21 51.75,46.99 51.75,44.13 v48.9,41.27 50.8,39.37 50.8,22.86 v49.53,21.59 51.12,20 51.12,15.43 49.66,13.97 v43.18,13.97
V-  (via drill 0.35)
  Top 0.2: C20.1 43.6,70.59 44.45,71.44 IC4.4 | C22.1 44.55,45.19 44.77,45.4 IC3.4 | C24.1 44.23,63.72 44.45,63.5 IC5.4 | v50.48,44.13 v51.75,42.86 | v55.56,47.31 55.46,47.41 R16.2 | IC6.4 45.24,55.35 C18.1 | C28.1 IC1.9 v48.58,32.38
  Top 0.508: IC2.4 v46.67,17.78 51.91,12.55 L2.1 55.72,12.55 56.52,11.75 57.92,11.75 C16.- | v47.31,45.4 IC3.4 | v46.99,55.56 IC6.4 | v46.99,63.5 IC5.4 | v46.99,71.44 IC4.4
  Bottom 0.2: v51.75,42.86 55.24,42.86 55.88,43.5 55.88,46.99 v55.56,47.31 | 46.04,44.13 v50.48,44.13
  Bottom 0.508: v46.99,71.44 47.62,70.8 47.62,64.14 v46.99,63.5 45.4,61.91 45.4,57.15 v46.99,55.56 44.45,53.02 44.45,48.26 v47.31,45.4 46.04,44.13 45.4,43.5 45.4,42.55 48.58,39.37 v48.58,32.38 48.58,32.36 50.14,30.8 50.14,29.53 49.34,28.73 48.57,28.73 48.11,28.27 48.11,27.61 48.26,27.46 48.26,20.64 46.67,19.05 v46.67,17.78

### Text on the board
bPlace: kocmoc svf / v 1.6 smd | power of the / hydro cubes